# Altium schematic sheet CRUVI.SchDoc: CRUVI
size A4; Organization: Trenz Electronic GmbH; DocumentNumber: CR00041; Revision: 01; SheetNumber: 1; SheetTotal: 2; Date: 2019-11-14; CompanyName: Trenz Electronic GmbH
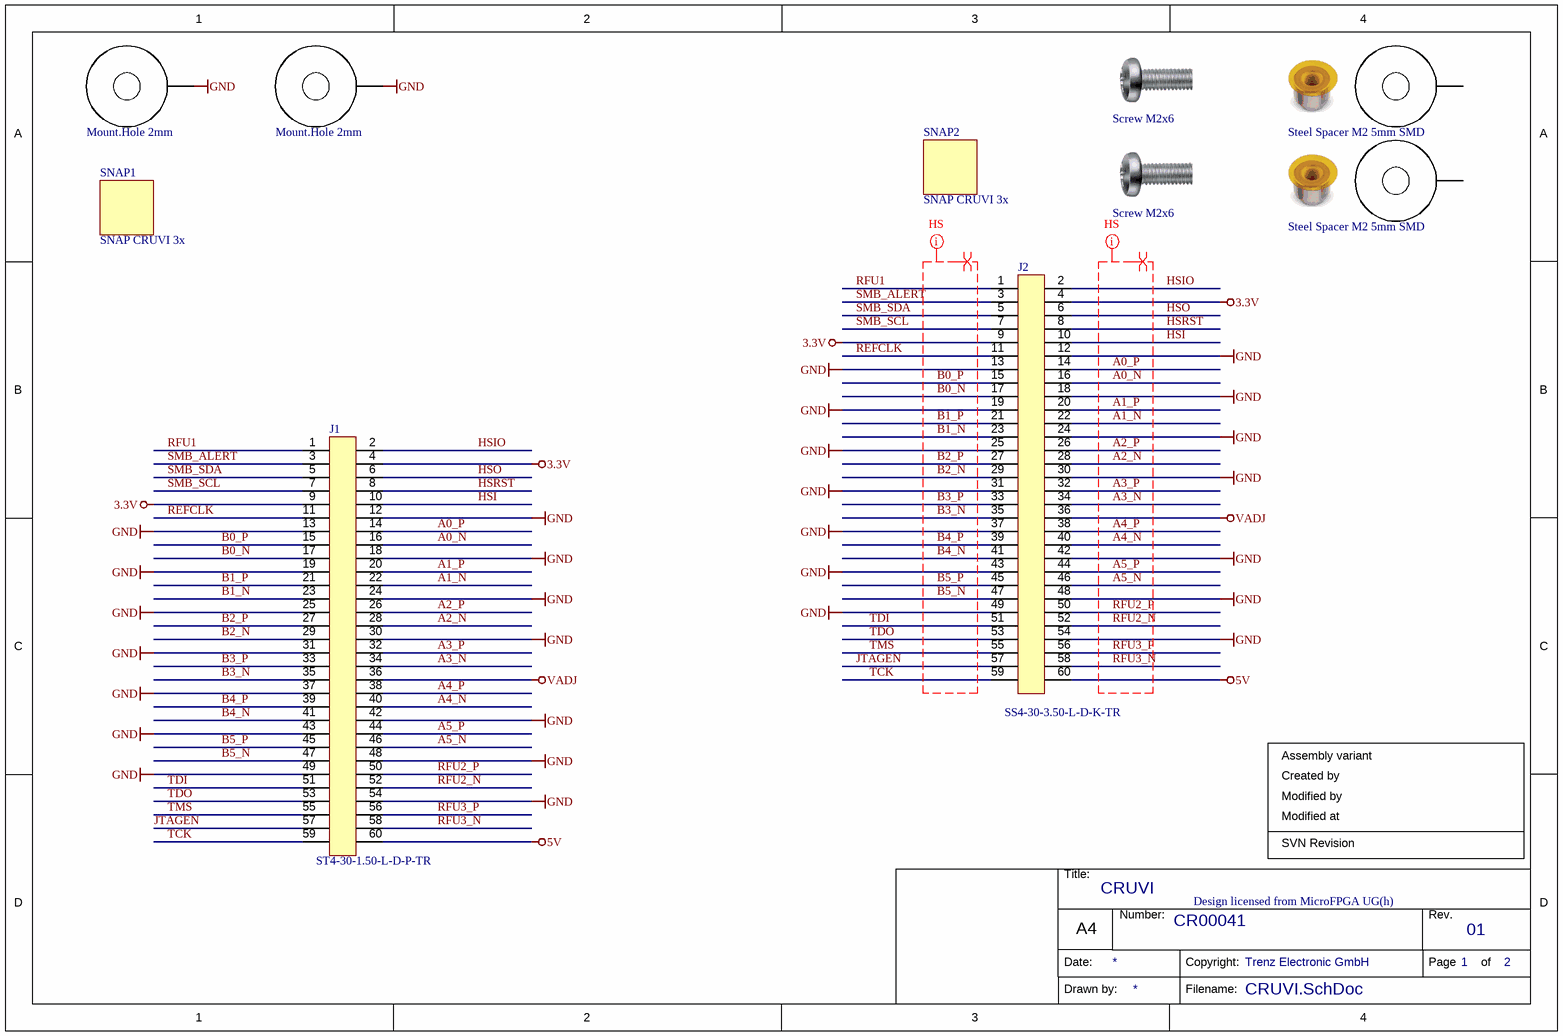
[diagram p0: CRUVI.SchDoc]

## Parts
H1  Mount.Hole 2mm  [MHole2_2mm]  (no BOM)
H2  Mount.Hole 2mm  [MHole2_2mm]  (no BOM)
H3  Steel Spacer M2 5mm SMD  [9774050243]
H4  Steel Spacer M2 5mm SMD  [9774050243]
J1  ST4-30-1.50-L-D-P-TR  [ST4-30-1_50-L-D]
J2  SS4-30-3.50-L-D-K-TR  [SS4-30-3_50-L-D]
MECH1  Screw M2x6  (mechanical)
MECH2  Screw M2x6  (mechanical)
SNAP1  SNAP CRUVI 3x  [CRUVI_3x_Snap]  (no BOM)
SNAP2  SNAP CRUVI 3x  [CRUVI_3x_Snap]  (no BOM)

## Nets
3.3V: J1.4 J1.9 J2.4 J2.9
5V: J1.60 J2.60
GND: H1.1 H2.1 J1.12 J1.13 J1.18 J1.19 J1.24 J1.25 J1.30 J1.31 J1.37 J1.42 J1.43 J1.48 J1.49 J1.54 J2.12 J2.13 J2.18 J2.19 J2.24 J2.25 J2.30 J2.31 J2.37 J2.42 J2.43 J2.48 J2.49 J2.54
VADJ: J1.36 J2.36
A0_N: J1.16 J2.16
A0_P: J1.14 J2.14
A1_N: J1.22 J2.22
A1_P: J1.20 J2.20
A2_N: J1.28 J2.28
A2_P: J1.26 J2.26
A3_N: J1.34 J2.34
A3_P: J1.32 J2.32
A4_N: J1.40 J2.40
A4_P: J1.38 J2.38
A5_N: J1.46 J2.46
A5_P: J1.44 J2.44
B0_N: J1.17 J2.17
B0_P: J1.15 J2.15
B1_N: J1.23 J2.23
B1_P: J1.21 J2.21
B2_N: J1.29 J2.29
B2_P: J1.27 J2.27
B3_N: J1.35 J2.35
B3_P: J1.33 J2.33
B4_N: J1.41 J2.41
B4_P: J1.39 J2.39
B5_N: J1.47 J2.47
B5_P: J1.45 J2.45
HSI: J1.10 J2.10
HSIO: J1.2 J2.2
HSO: J1.6 J2.6
HSRST: J1.8 J2.8
JTAGEN: J1.57 J2.57
REFCLK: J1.11 J2.11
RFU1: J1.1 J2.1
RFU2_N: J1.52 J2.52
RFU2_P: J1.50 J2.50
RFU3_N: J1.58 J2.58
RFU3_P: J1.56 J2.56
SMB_ALERT: J1.3 J2.3
SMB_SCL: J1.7 J2.7
SMB_SDA: J1.5 J2.5
TCK: J1.59 J2.59
TDI: J1.51 J2.51
TDO: J1.53 J2.53
TMS: J1.55 J2.55

Not connected (* = marked no-connect by the designer): H3 1; H4 1

## Layout directives
differential pair: A0_N, A0_P, A1_N, A1_P, A2_N, A2_P, A3_N, A3_P, A4_N, A4_P, A5_N, A5_P, B0_N, B0_P, B1_N, B1_P, B2_N, B2_P, B3_N, B3_P, B4_N, B4_P, B5_N, B5_P, RFU2_N, RFU2_P, RFU3_N, RFU3_P
net class HS: A0_N, A0_P, A1_N, A1_P, A2_N, A2_P, A3_N, A3_P, A4_N, A4_P, A5_N, A5_P, B0_N, B0_P, B1_N, B1_P, B2_N, B2_P, B3_N, B3_P, B4_N, B4_P, B5_N, B5_P, RFU2_N, RFU2_P, RFU3_N, RFU3_P

## Notes on the sheet
- Assembly variant
- Created by
- Modified at
- Modified by
- SVN Revision
- Design licensed from MicroFPGA UG(h)
- Title:
- Number:
- Rev.
- Date:
- A4
- Copyright:
- Page
- of
- Drawn by:
- Filename:

## Library data of the parts
H1 H2 = 27273: AN: 27273; Mixed: THT
H3 H4 = 29745: 9774050243R; AN: 29745; Mixed: SMT; Extra: SMT Steel Spacer, M2 5mm; HelpURL: b:\AD\adlib\datasheet\9774050243R\; H-ART: 9774050243R
J1 = 29686: AN: 29686; Mixed: SMT; Temperature-Range: -55/+125; Case: ST4; HelpURL: b:\AD\adlib\datasheet\Samtec_ST4\; H-ART: ST4-30-1.50-L-D-P-TR
J2 = 29747: SS4-30-3.50-L-D-K; AN: 29747; Mixed: SMT; Temperature-Range: -55/+125; Extra: Samtec Ultra-Fine Pitch Header 60 pins, 0.4mm pitch, 4.00 mm height; Case: SS4; HelpURL: b:\AD\adlib\datasheet\Samtec_ST4\; H-ART: SS4-30-3.50-L-D-K-TR
MECH1 MECH2 = 26352: Schraube M2x6mm; AN: 26352; Mixed: MECH; Extra: Kreuz, Linsenkopf DIN7985 Edelstahl; HelpURL: b:\AD\adlib\datasheet\Ettinger\
SNAP1 SNAP2 = 29977: SNAP for CRUVI 3x; AN: 29977